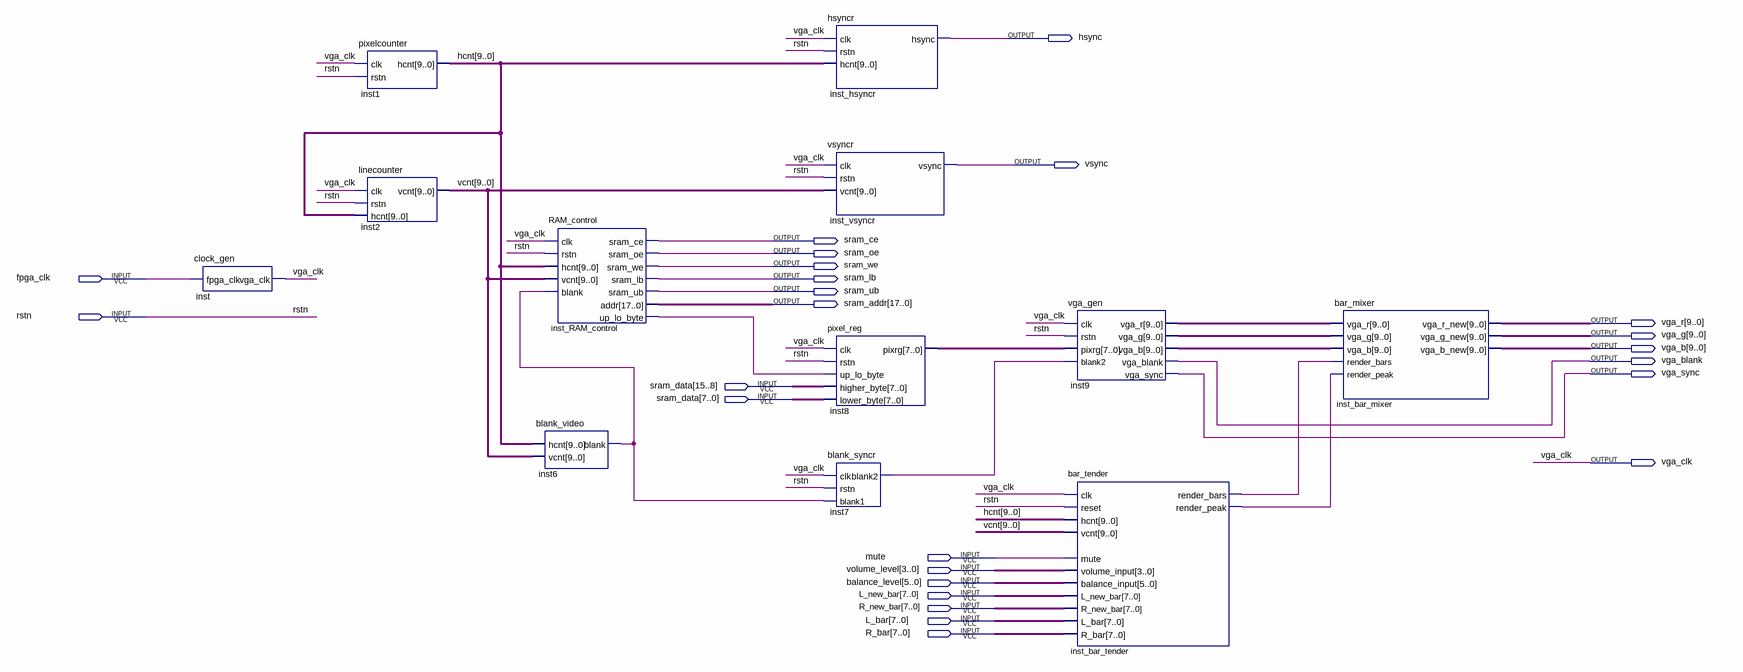
[diagram p0: schematic sheet]
// Quartus schematic VGA_Driver.bdf as structural Verilog: 12 symbols, 25 pins
module VGA_Driver (
  input  fpga_clk,
  input  rstn,
  input  [15:0] sram_data,
  input  mute,
  input  [3:0] volume_level,
  input  [5:0] balance_level,
  input  [7:0] L_new_bar,
  input  [7:0] R_new_bar,
  input  [7:0] L_bar,
  input  [7:0] R_bar,
  output hsync,
  output vsync,
  output sram_ce,
  output sram_oe,
  output sram_we,
  output sram_lb,
  output sram_ub,
  output [17:0] sram_addr,
  output [9:0] vga_r,
  output [9:0] vga_g,
  output [9:0] vga_b,
  output vga_blank,
  output vga_sync,
  output vga_clk
);

  wire inst6_blank, inst7_blank2, inst_bar_tender_render_bars, inst_bar_tender_render_peak,
       inst_RAM_control_up_lo_byte;
  wire [7:0] inst8_pixrg;
  wire [9:0] hcnt, inst9_vga_b, inst9_vga_g, inst9_vga_r, vcnt;

  clock_gen inst (.fpga_clk(fpga_clk), .vga_clk(vga_clk));
  pixelcounter inst1 (.clk(vga_clk), .rstn(rstn), .hcnt(hcnt));
  linecounter inst2 (.clk(vga_clk), .hcnt(hcnt), .rstn(rstn), .vcnt(vcnt));
  blank_video inst6 (.vcnt(vcnt), .hcnt(hcnt), .blank(inst6_blank));
  RAM_control inst_RAM_control (
    .clk(vga_clk), .rstn(rstn), .hcnt(hcnt), .vcnt(vcnt), .blank(inst6_blank),
    .up_lo_byte(inst_RAM_control_up_lo_byte), .addr(sram_addr), .sram_ce(sram_ce), .sram_oe(sram_oe),
    .sram_we(sram_we), .sram_lb(sram_lb), .sram_ub(sram_ub));
  hsyncr inst_hsyncr (.clk(vga_clk), .hcnt(hcnt), .rstn(rstn), .hsync(hsync));
  vsyncr inst_vsyncr (.clk(vga_clk), .vcnt(vcnt), .rstn(rstn), .vsync(vsync));
  pixel_reg inst8 (
    .clk(vga_clk), .rstn(rstn), .up_lo_byte(inst_RAM_control_up_lo_byte), .higher_byte(sram_data[15:8]),
    .lower_byte(sram_data[7:0]), .pixrg(inst8_pixrg));
  blank_syncr inst7 (.clk(vga_clk), .rstn(rstn), .blank1(inst6_blank), .blank2(inst7_blank2));
  vga_gen inst9 (
    .clk(vga_clk), .rstn(rstn), .pixrg(inst8_pixrg), .blank2(inst7_blank2), .vga_r(inst9_vga_r),
    .vga_g(inst9_vga_g), .vga_b(inst9_vga_b), .vga_blank(vga_blank), .vga_sync(vga_sync));
  bar_tender inst_bar_tender (
    .balance_input(balance_level), .volume_input(volume_level), .L_bar(L_bar), .R_bar(R_bar),
    .L_new_bar(L_new_bar), .R_new_bar(R_new_bar), .hcnt(hcnt), .vcnt(vcnt), .mute(mute), .clk(vga_clk),
    .reset(rstn), .render_bars(inst_bar_tender_render_bars), .render_peak(inst_bar_tender_render_peak));
  bar_mixer inst_bar_mixer (
    .vga_r(inst9_vga_r), .vga_g(inst9_vga_g), .vga_b(inst9_vga_b), .render_bars(inst_bar_tender_render_bars),
    .render_peak(inst_bar_tender_render_peak), .vga_r_new(vga_r), .vga_g_new(vga_g), .vga_b_new(vga_b));
endmodule
